# EAGLE schematic ntp-alarm-clock (EAGLE 7.7.0)

## Sheet 1 of 2: Power n' such
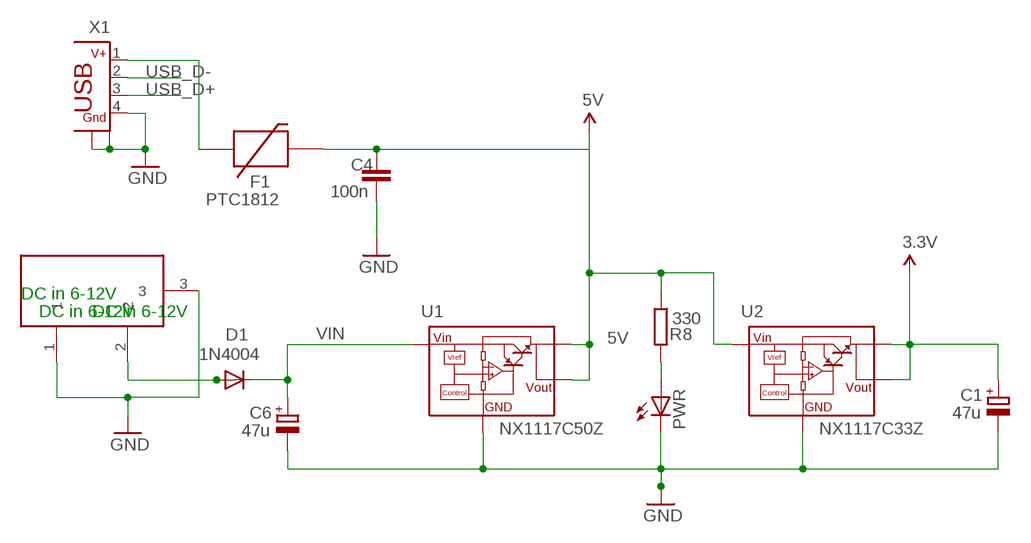
[diagram p0: schematic, sheet 1]

### Parts
C1  47u  CPOL-EUD  [PANASONIC_D]
C4  100n  C-EUC1206  [C1206]
C6  47u  CPOL-EUD  [PANASONIC_D]
D1  1N4004  DIODESMA  [SMA-DIODE]
DC1  9V in  DC21MMX  [DC-21MM]
F1  PTC1812  [C1812]
PWR  LED-LCC1206  [LCC1206]
R8  330  R-EU_R1206  [R1206]
U1  NX1117C50Z  [SOT223]
U2  NX1117C33Z  [SOT223]
X1  CON-USB-B  [USB-WSHIELDPADS]

### Nets
3.3V: C1.+ U2.2(VOUT1) U2.4(VOUT) ; also sheet 2
5V: C4.2 F1.2 R8.1 U1.2(VOUT1) U1.4(VOUT) U2.3(VIN)
GND [power]: C1.- C4.1 C6.- DC1.1 DC1.3 PWR.C U1.1(GND) U2.1(GND) X1.4 X1.SH1(GND) X1.SH2(GND) ; also sheet 2
N$3: PWR.A R8.2
N$45: D1.A DC1.2
USB_D+: X1.3 ; also sheet 2
USB_D-: X1.2 ; also sheet 2
USBV+ [power]: F1.1 X1.1
VIN [power]: C6.+ D1.C U1.3(VIN)

### Notes on the sheet
- DC in 6-12V
- DC in 6-12V | DC in 6-12V

## Sheet 2 of 2: MCU n' such
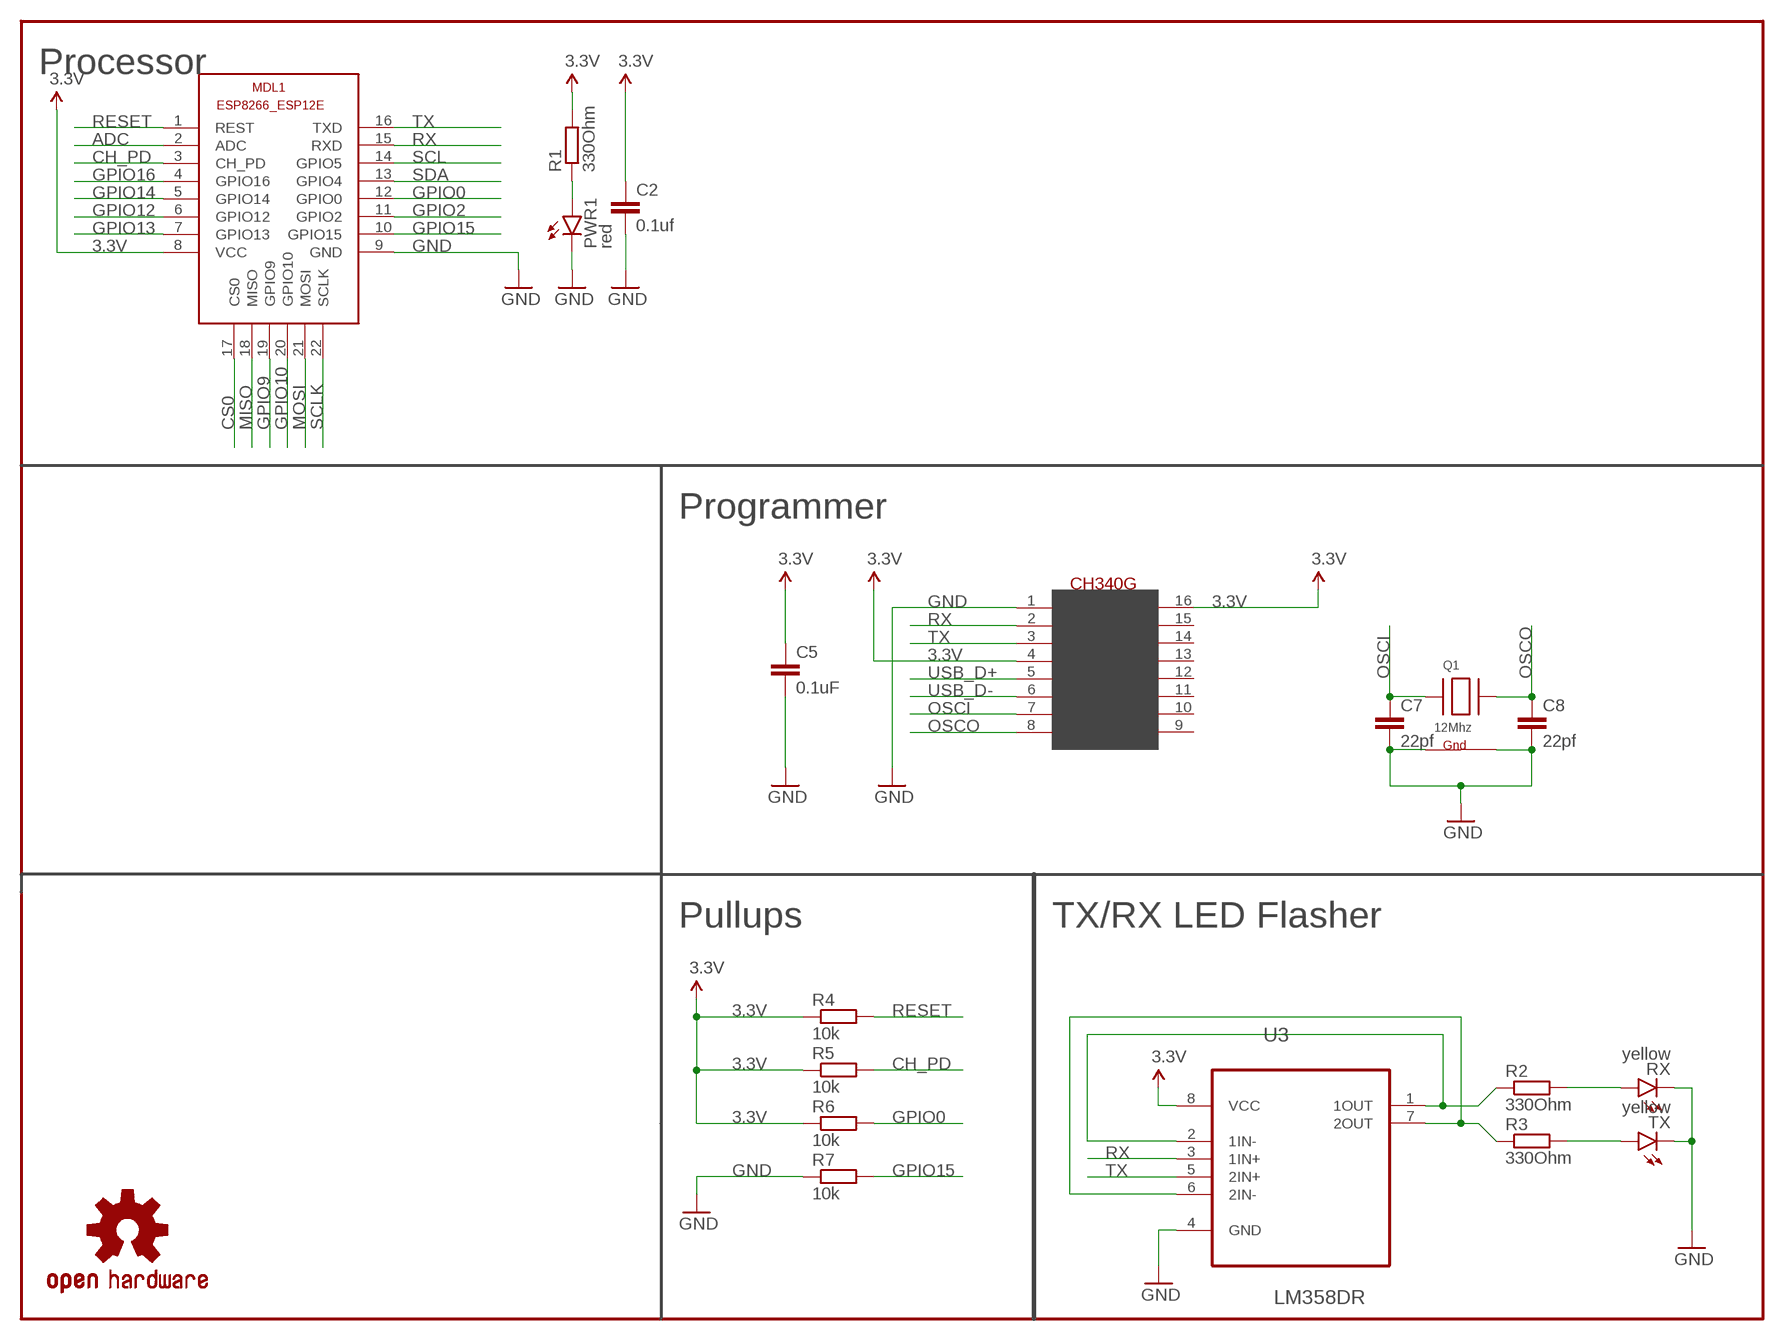
[diagram p1: schematic, sheet 2]

### Parts
C2  0.1uf  C-EUC0805  [C0805]
C5  0.1uF  C-EUC0805  [C0805]
C7  22pf  C-EUC0805  [C0805]
C8  22pf  C-EUC0805  [C0805]
FRAME1  FRAME-LETTERNO_PACKAGE  [DUMMY]
LOGO1  OSHW-LOGOS  [OSHW-LOGO-S]
MDL1  ESP8266-12EESP8266-ESP12E  [ESP8266-ESP12E]
PWR1  red  LED0603  [LED-0603]
Q1  12Mhz  XTAL-4-3225  [NX3225]
R1  330Ohm  R-EU_R0805  [R0805]
R2  330Ohm  R-EU_R0805  [R0805]
R3  330Ohm  R-EU_R0805  [R0805]
R4  10k  R-EU_R0805  [R0805]
R5  10k  R-EU_R0805  [R0805]
R6  10k  R-EU_R0805  [R0805]
R7  10k  R-EU_R0805  [R0805]
RX  yellow  LED0603  [LED-0603]
TX  yellow  LED0603  [LED-0603]
U3  LM358DR  [SOIC127P600X175-8N]
U$2  CH340G  [SOIC16]

### Nets
3.3V: C2.1 C5.1 MDL1.8(VCC) R1.2 R4.1 R5.1 R6.1 U3.8(VCC) U$2.4(V3) U$2.16(VCC) ; also sheet 1
ADC: MDL1.2(ADC)
CH_PD: MDL1.3(CH_PD) R5.2
CS0: MDL1.17(CS0)
GND [power]: C2.2 C5.2 C7.2 C8.2 MDL1.9(GND) PWR1.C Q1.2(G2) Q1.4(G1) R7.1 RX.C TX.C U3.4(GND) U$2.1(GND) ; also sheet 1
GPIO0: MDL1.12(GPIO0) R6.2
GPIO2: MDL1.11(GPIO2)
GPIO9: MDL1.19(GPIO9)
GPIO10: MDL1.20(GPIO10)
GPIO12: MDL1.6(GPIO12)
GPIO13: MDL1.7(GPIO13)
GPIO14: MDL1.5(GPIO14)
GPIO15: MDL1.10(GPIO15) R7.2
GPIO16: MDL1.4(GPIO16)
MISO: MDL1.18(MISO)
MOSI: MDL1.21(MOSI)
N$1: PWR1.A R1.1
N$2: R2.1 U3.1(1OUT) U3.2(1IN-)
N$4: R3.1 U3.6(2IN-) U3.7(2OUT)
N$5: R3.2 TX.A
N$6: R2.2 RX.A
OSCI: C7.1 Q1.1(X1) U$2.7(XI)
OSCO: C8.1 Q1.3(X2) U$2.8(XO)
RESET: MDL1.1(REST) R4.2
RX: MDL1.15(RXD) U3.3(1IN+) U$2.2(TX)
SCL: MDL1.14(GPIO5)
SCLK: MDL1.22(SCLK)
SDA: MDL1.13(GPIO4)
TX: MDL1.16(TXD) U3.5(2IN+) U$2.3(RX)
USB_D+: U$2.5(D+) ; also sheet 1
USB_D-: U$2.6(D-) ; also sheet 1
Unconnected: U$2.9(CTS) U$2.10(DSR) U$2.11(RI) U$2.12(DCD) U$2.13(DTR) U$2.14(RTS) U$2.15(RS232)

### Notes on the sheet
- Processor
- Programmer
- Pullups | TX/RX LED Flasher

## Library data of the parts
C1 C6 = rcl:CPOL-EU: POLARIZED CAPACITOR, European symbol
C2 C4 C5 C7 C8 = rcl:C-EU: CAPACITOR, European symbol
D1 = SparkFunEagle-6-6-07:DIODE: Diode These are standard reverse protection diodes and small signal diodes. SMA package can handle up to about 1A. SOD-323 can handle about 200mA. What the SOD-323 package when ordering, there are some mfgs out there that are 5-pin packages.
DC1 = powersupply:DC21MM
F1 = SparkFunEagle-6-6-07:PTC: Resettable Fuse PTC Resettable Fuse. Spark Fun Electronics SKU : COM-08357
FRAME1 = SparkFun-Aesthetics:FRAME-LETTER: Schematic Frame Standard 8.5x11 US Letter frame; DESIGNER: Nobody; VERSION: v01
LOGO1 = SparkFun-Aesthetics:OSHW-LOGO: Open Source Hardware Logo This logo indicates the piece of hardware it is found on incorporates a OSHW license and/or adheres to the definition of open source hardware found here: http://freedomdefined.org/OSHW
MDL1 = ESP8266-ESP12E:ESP8266-12E: ESP8266-12E with additional I/O and GPIO04/05 corrected The author cannot warrant that this library is free from error or will meet your specific requirements. Created by PuceBaboon.com. Komagane, Nagano, JAPAN
PWR = my-led:LED: LED OSRAM: - CHIPLED LG R971, LG N971, LY N971, LG Q971, LY Q971, LO R971, LY R971 LH N974, LH R974 LS Q976, LO Q976, LY Q976 LO Q996 - Hyper CHIPLED LW Q18S LB Q993, LB Q99A, LB R99A - SideLED LS A670, LO A670, LY A670, LG A670, LP A670 LB A673, LV A673, LT A673, LW A673 LH A674 LY A675 LS A676, LA A676, LO A676, LY A676, LW A676 LS A679, LY A679, LG A679 - Hyper Micro SIDELED® LS Y876, LA Y876, LO Y876, LY Y876 LT Y87S - SmartLED LW L88C, LW L88S LB L89C, LB L89S, LG L890 LS L89K, LO L89K, LY L89K LS L896, LA L896, LO L896, LY L896 - TOPLED LS T670, LO T670, LY T670, LG T670, LP T670 LSG T670, LSP T670, LSY T670, LOP T670, LYG T670 LG T671, LOG T671, LSG T671 LB T673, LV T673, LT T673, LW T673 LH T674 LS T676, LA T676, LO T676, LY T676, LB T676, LH T676, LSB T676, LW T676 LB T67C, LV T67C, LT T67C, LS T67K, LO T67K, LY T67K, LW E67C LS E67B, LA E67B, LO E67B, LY E67B, LB E67C, LV E67C, LT E67C LW T67C LS T679, LY T679, LG T679 LS T770, LO T770, LY T770, LG T770, LP T770 LB T773, LV T773, LT T773, LW T773 LH T774 LS E675, LA E675, LY E675, LS T675 LS T776, LA T776, LO T776, LY T776, LB T776 LHGB T686 LT T68C, LB T68C - Hyper Mini TOPLED® LB M676 - Mini TOPLED Santana® LG M470 LS M47K, LO M47K, LY M47K Source: http://www.osram.convergy.de/
PWR1 RX TX = SparkFun-LED:LED: LEDs Standard schematic elements and footprints for 5mm, 3mm, 1206, and 0603 sized LEDs. 5mm - Spark Fun Electronics SKU : COM-00529 (and others)
Q1 = adafruit:XTAL-4: Classic 4-pin 3.2 x 2.5mm crystal
R1-R8 = rcl:R-EU_: RESISTOR, European symbol
U1 = nxp_60:NX1117C: The NX1117C/NX1117CE are two series of low-dropout positive voltage regulators with an output current capability of 1 A. AAL Eindhoven MK; 12NC: 9352 914 43115; TOLERANCE: 1.25%; VOLTAGE: 5.0V
U2 = nxp_60:NX1117C: The NX1117C/NX1117CE are two series of low-dropout positive voltage regulators with an output current capability of 1 A. AAL Eindhoven MK; 12NC: 9352 914 42115; TOLERANCE: 1.25%; VOLTAGE: 5.0V
U3 = Texas Instruments_By_element14_Batch_1:LM358DR: OPERATIONAL AMPLIFIERS; MPN: LM358DR; OC_FARNELL: 1831865; OC_NEWARK: 34K7599; PACKAGE: SOIC-8; SUPPLIER: Texas Instruments
U$2 = CH340G-USB-SERIAL:CH340G
X1 = mylib4:CON-USB-B: BERG USB connector

## Net classes
1 power: width 0.508 mm, clearance 0.305 mm
2 finepitch: width 0.203 mm, clearance 0.203 mm